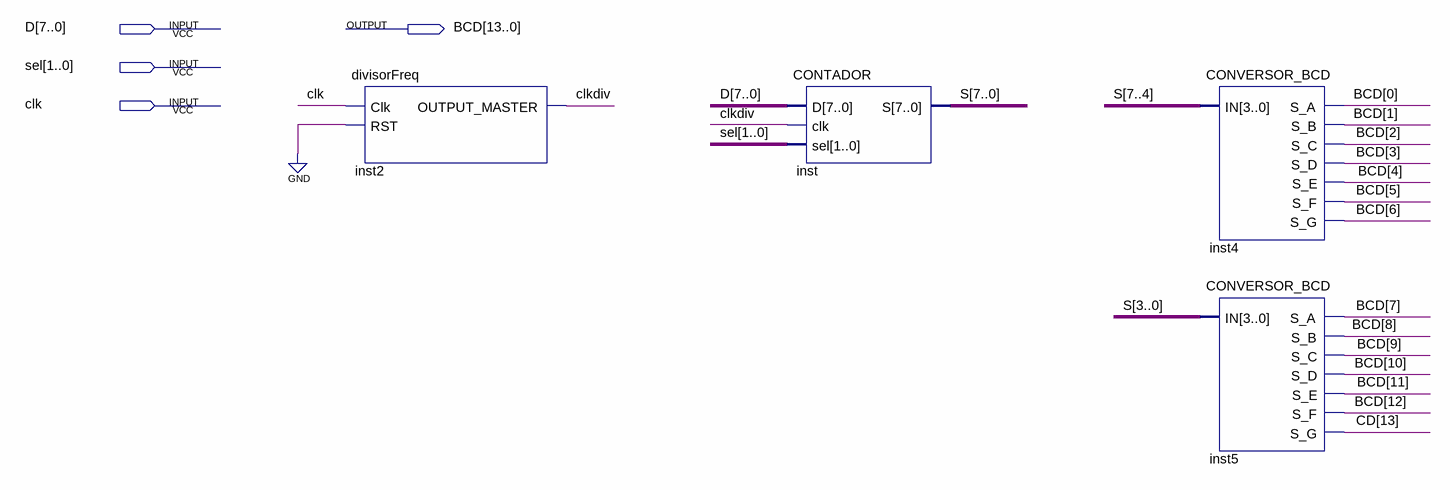
[diagram p0: schematic sheet]
// Quartus schematic LAB8.bdf as structural Verilog: 4 symbols, 4 pins
module LAB8 (
  input  [7:0] D,
  input  [1:0] sel,
  input  clk,
  output [13:0] BCD
);

  wire clkdiv;
  wire [7:0] S;
  wire [13:13] CD;

  divisorFreq inst2 (.Clk(clk), .RST(1'b0), .OUTPUT_MASTER(clkdiv));
  CONTADOR inst (.D(D), .clk(clkdiv), .sel(sel), .S(S));
  CONVERSOR_BCD inst4 (
    .IN(S[7:4]), .S_A(BCD[0]), .S_B(BCD[1]), .S_C(BCD[2]), .S_D(BCD[3]), .S_E(BCD[4]), .S_F(BCD[5]),
    .S_G(BCD[6]));
  CONVERSOR_BCD inst5 (
    .IN(S[3:0]), .S_A(BCD[7]), .S_B(BCD[8]), .S_C(BCD[9]), .S_D(BCD[10]), .S_E(BCD[11]), .S_F(BCD[12]),
    .S_G(CD[13]));
endmodule
